# EAGLE design example_3_AMmodulation (EAGLE 9.4.2)
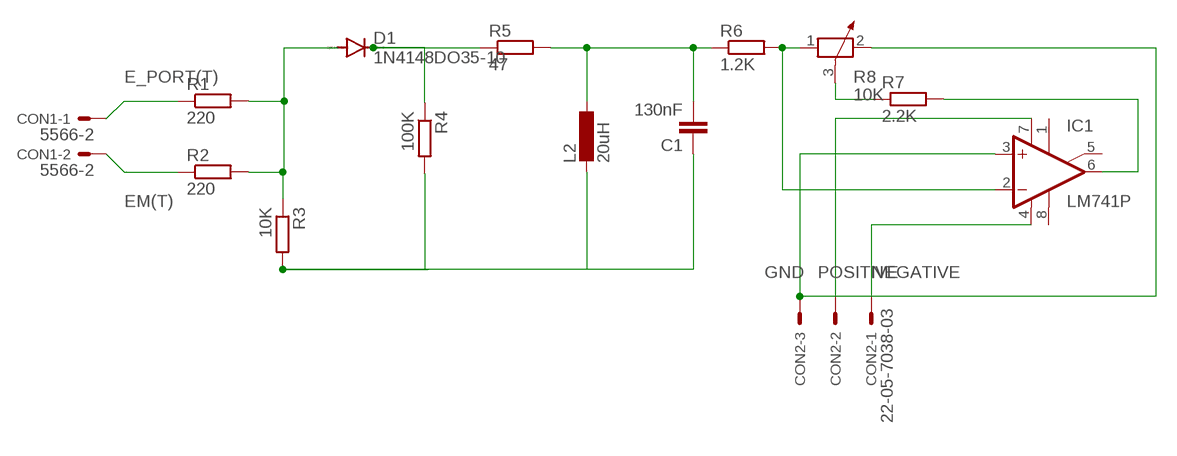
[diagram p0: schematic, sheet 1]

## Parts
C1  130nF  C-EU025-025X050  [C025-025X050]
CON1  5566-2  [5566-2]
CON2  22-05-7038-03  [7395-03]
D1  1N4148DO35-10  [DO35-10]
IC1  LM741P  [DIL08]
L2  20uH  L-EU0204/7  [0204/7]
R1  220  R-EU_0204/7  [0204/7]
R2  220  R-EU_0204/7  [0204/7]
R3  10K  R-EU_0204/7  [0204/7]
R4  100K  R-EU_0204/7  [0204/7]
R5  47  R-EU_0204/7  [0204/7]
R6  1.2K  R-EU_0204/7  [0204/7]
R7  2.2K  R-EU_0204/7  [0204/7]
R8  10K  POTENTIOMETER_PT-10  [PT-10]

## Nets
E_PORT(T): CON1.1 R1.1
EM(T): CON1.2 R2.1
GND: CON2.3 IC1.3(+IN) R8.2
N$1: D1.A R1.2 R2.2 R3.1
N$2: IC1.2(-IN) R6.2 R8.1
N$3: D1.C R4.1 R5.1
N$4: C1.2 L2.1 R5.2 R6.1
N$5: R7.1 R8.3
N$6: C1.1 L2.2 R3.2 R4.2
N$7: IC1.6(OUT) R7.2
NEGATIVE: CON2.1 IC1.4(V-)
POSITIVE: CON2.2 IC1.7(V+)
Unconnected: IC1.1(ON1) IC1.5(ON2) IC1.8(OPT)

## Library data of the parts
C1 = rcl:C-EU: CAPACITOR, European symbol; SPICEPREFIX: C
CON1 = con-molex:5566-2: Mini FIT connector 2 pol Source: http://www.molex.com; MF: MOLEX; OC_FARNELL: 1822072; OC_NEWARK: unknown
CON2 = con-molex:22-?-03: CONNECTOR wire to board 2.54 mm (.1 inch) pitch header; MF: MOLEX; OC_FARNELL: unknown; OC_NEWARK: unknown
D1 = diode:1N4148: DIODE high speed (Philips)
IC1 = linear:*741: OP AMP
L2 = rcl:L-EU: INDUCTOR, European symbol; SPICEPREFIX: L
R1-R7 = rcl:R-EU_: RESISTOR, European symbol; SPICEPREFIX: R
R8 = rcl:POTENTIOMETER_: Potentiometer; SPICEMODEL: POT; SPICEPREFIX: X

## Board
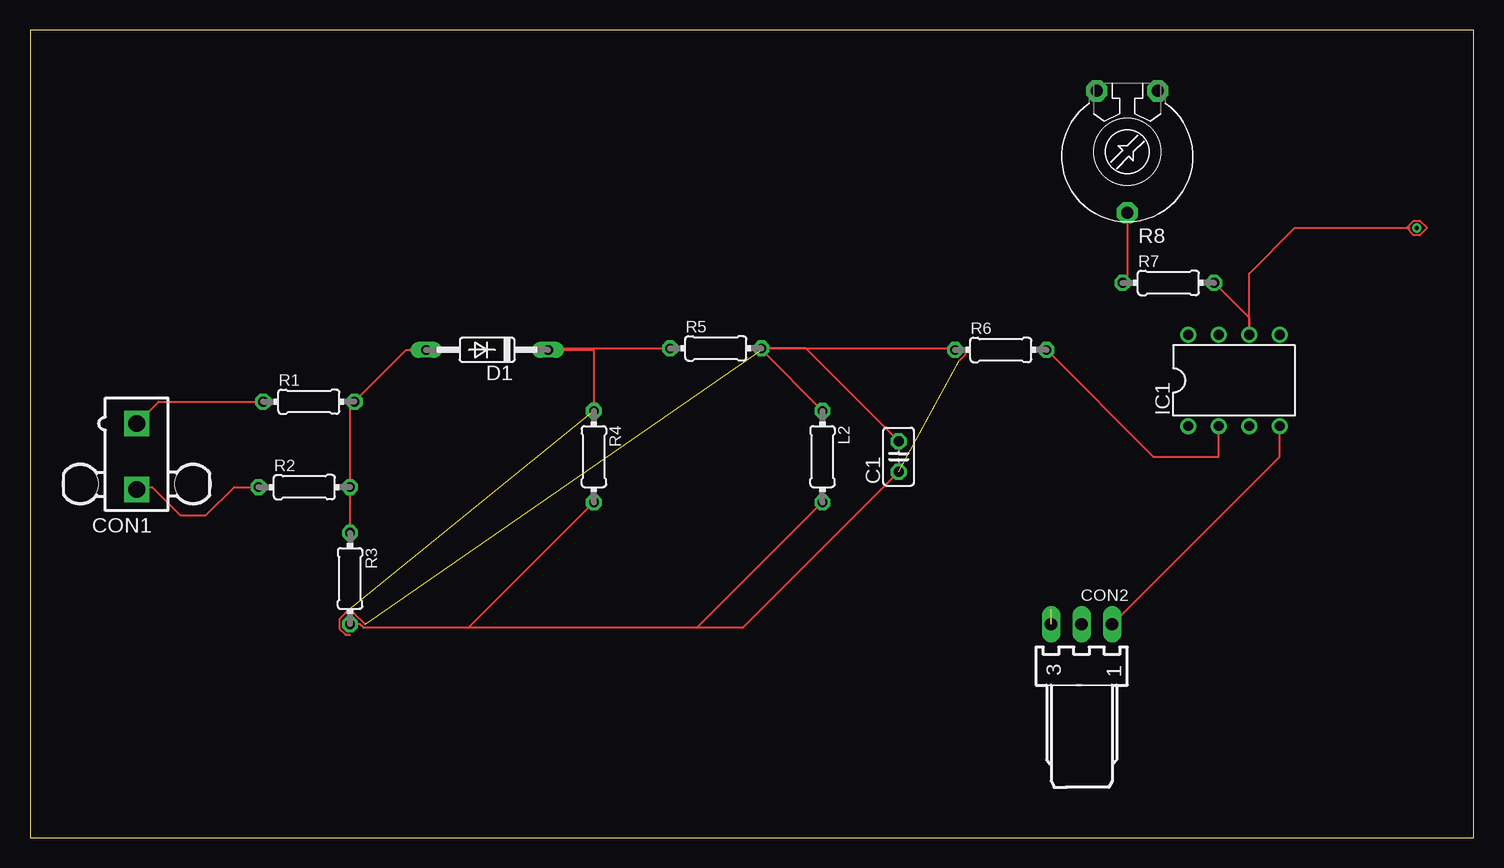
[diagram p1: board, top side]
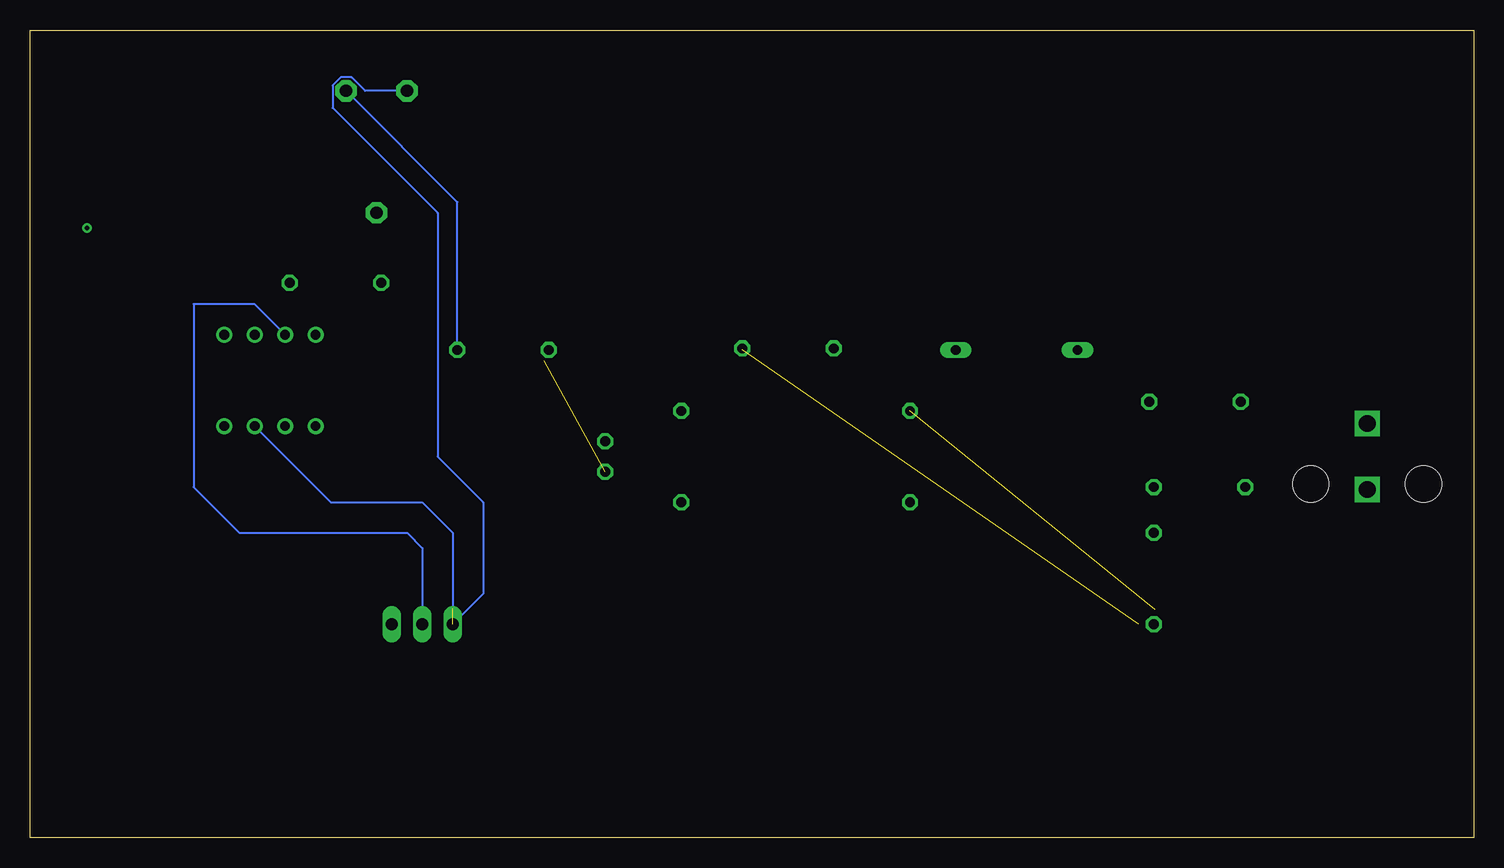
[diagram p2: board, bottom side, seen from below]

Size 120.32 x 67.3 mm. Coordinates in mm from the lower left corner, seen from the top.
Outline: 0,0 120.32,0 120.32,67.3 0,67.3 0,0
Copper layers (1*16): Top 0.035mm / dielectric 1.5mm / Bottom 0.035mm
Design rules "default": minimum track width 6mil, minimum drill 0.35mm, track to track 6mil, track to pad 6mil, pad to pad 6mil, via to via 6mil, smd to smd 6mil, copper to edge 40mil, drill to drill 6mil, minimum pad ring 10mil, minimum via ring 8mil, stop-mask expansion 4mil, vias tented up to drill 0mil, thermal gap 10mil

### Footprints (pad centres in the part's own frame; a part is rotated, then mirrored left to right if it is on the bottom)
C025-025X050 = drill 0.813 octagon: 1 -1.27,0; 2 1.27,0
5566-2 = drill 1.4 square: 1 0,-2.75; 2 0,2.75 | hole 3: 4.7,2.29; -4.7,2.29
7395-03 = drill 1.016 long: 1 2.54,0; 2 0,0; 3 -2.54,0
DO35-10 = drill 0.813 long: A 5.08,0; C -5.08,0
DIL08 = drill 0.813 pad 1.27: 1 -3.81,-3.81; 2 -1.27,-3.81; 3 1.27,-3.81; 4 3.81,-3.81; 5 3.81,3.81; 6 1.27,3.81; 7 -1.27,3.81; 8 -3.81,3.81
0204/7 = drill 0.813 octagon: 1 -3.81,0; 2 3.81,0
PT-10 = drill 1.016 pad 1.778 octagon: 1 -2.54,-5.08; 2 2.54,-5.08; 3 0,5.08

### Placement (x,y rotation side)
C1  72.39,31.75 90 top
CON1  8.89,31.75 180 top
CON2  87.63,17.78 0 top
D1  38.1,40.64 180 top
IC1  100.33,38.1 0 top
L2  66.04,31.75 270 top
R1  23.24,36.32 0 top
R2  22.86,29.21 0 top
R3  26.67,21.59 270 top
R4  46.99,31.75 270 top
R5  57.15,40.77 0 top
R6  80.9,40.64 0 top
R7  94.87,46.23 0 top
R8  91.44,57.15 180 top

### Tracks (layer width: path | path; a pad name or v marks a point on that pad's centre or on a via)
E_PORT(T)
  Top 0.152: CON1.1 10.71,36.32 R1.1
EM(T)
  Top 0.152: CON1.2 9.1,29.21 10.17,29.21 12.52,26.87 14.66,26.87 17.01,29.21 R2.1
GND  (1 unrouted)
  Bottom 0.152: R8.2 92.4,62.23 93.52,63.35 94.44,63.35 95.1,62.69 95.1,60.81 86.36,52.07 86.36,31.75 82.55,27.94 82.55,20.32 CON2.3 | IC1.3 95.25,27.94 87.63,27.94 85.09,25.4 85.09,19.05
N$1
  Top 0.152: D1.A 31.37,40.64 27.11,36.39 R1.2 26.67,35.94 R2.2 R3.1
N$2
  Top 0.152: R6.2 93.6,31.75 99.06,31.75 IC1.2
  Bottom 0.152: R6.2 84.71,52.96 R8.1
N$3  (1 unrouted)
  Top 0.152: R5.1 43.31,40.77 D1.C 46.99,40.64 R4.1 | 26.67,16.89 26.3,16.89 25.78,17.41 25.78,18.21 26.54,18.97
N$4  (1 unrouted)
  Top 0.152: R5.2 76.96,40.77 R6.1 | 26.67,18.67 27.04,18.67 27.93,17.78 | C1.2 64.64,40.77 R5.2 | L2.1 60.96,40.64 R5.2
N$5
  Top 0.152: R8.3 91.44,46.61 R7.1
N$6  (1 unrouted)
  Top 0.152: 77.46,39.75 77.98,40.27 77.98,40.64 | 36.52,17.48 27.8,17.48 27.5,17.78 R3.2 | R4.2 36.52,17.48 | 36.52,17.48 55.58,17.48 L2.2 | 36.52,17.48 59.38,17.48 C1.1
N$7
  Top 0.152: R7.2 101.6,43.31 IC1.6 101.6,46.99 105.41,50.8 114.71,50.8 | 114.96,50.8 114.71,50.8 | 114.71,50.8 115.32,51.41 115.82,51.41 116.43,50.8 115.82,50.19 115.32,50.19 114.71,50.8
N$8  (via drill 0.35)
  other vias: 115.57,50.8
NEGATIVE
  Top 0.152: CON2.1 104.14,31.75 IC1.4
POSITIVE
  Bottom 0.152: IC1.7 101.6,44.45 106.68,44.45 106.68,29.21 102.87,25.4 88.9,25.4 87.63,24.13 CON2.2